# Altium schematic sheet 00_sch_notes.SchDoc
size A
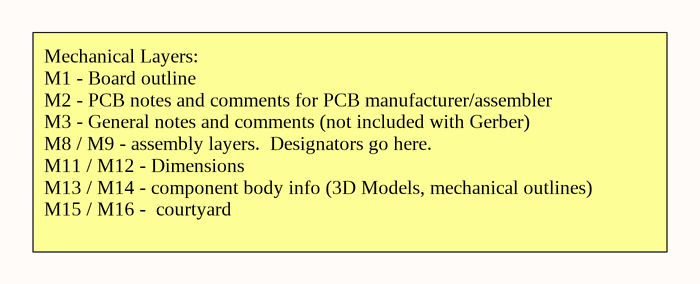
[diagram p0: 00_sch_notes.SchDoc]

## Notes on the sheet
- Mechanical Layers:
  M1 - Board outline
  M2 - PCB notes and comments for PCB manufacturer/assembler
  M3 - General notes and comments (not included with Gerber)
  M8 / M9 - assembly layers.  Designators go here.
  M11 / M12 - Dimensions
  M13 / M14 - component body info (3D Models, mechanical outlines)
  M15 / M16 -  courtyard